# EAGLE design sch (EAGLE 7.6.0)
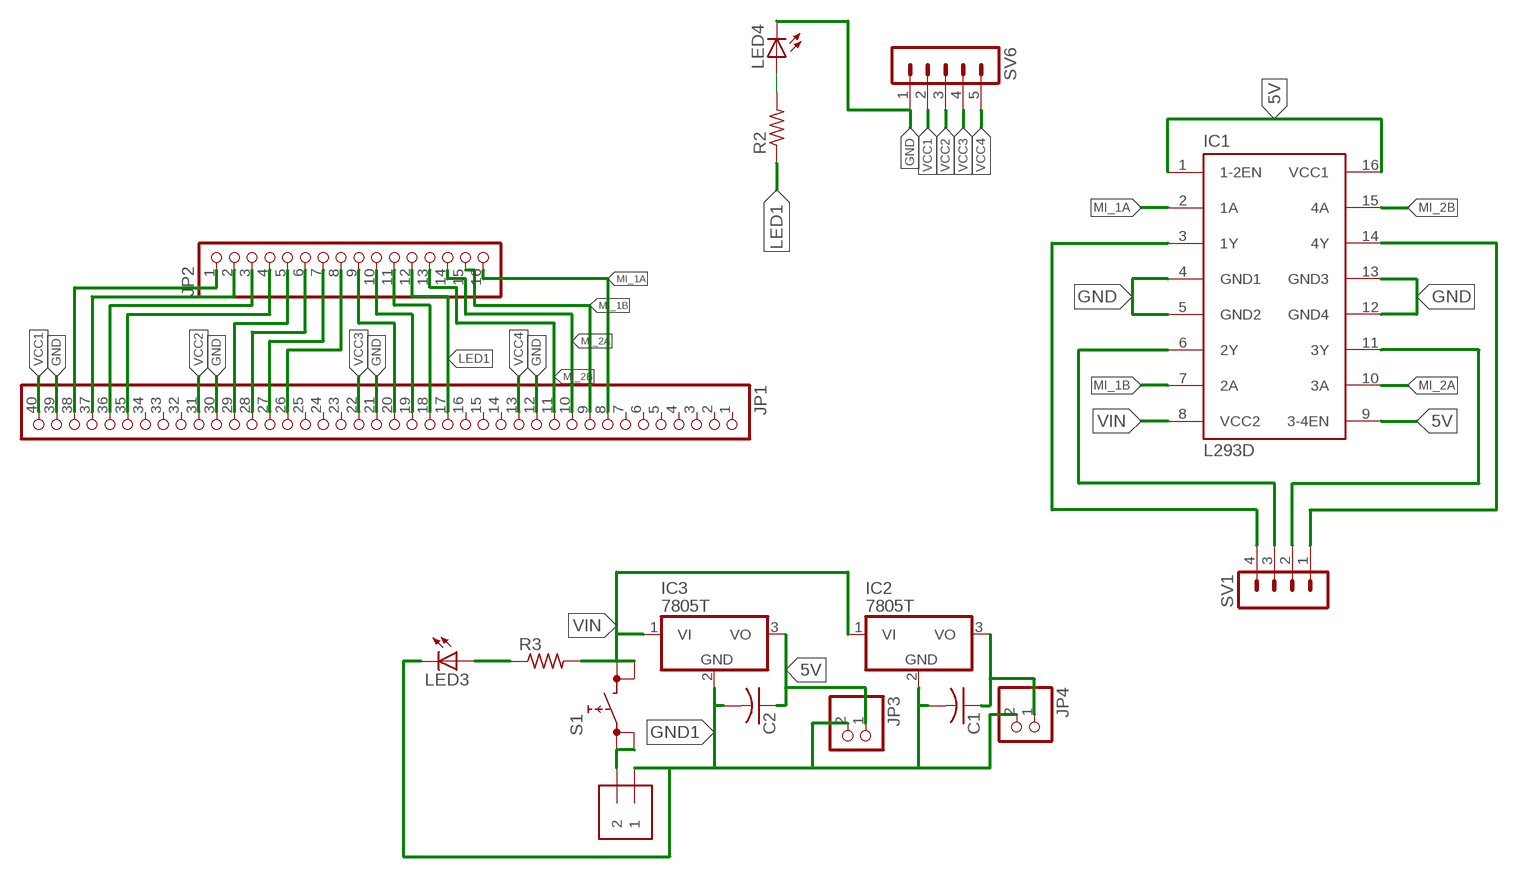
[diagram p0: schematic, sheet 1]

## Parts
C1  C-US025-024X044  [C025-024X044]
C2  C-US025-024X044  [C025-024X044]
IC1  L293D  [DIL16]
IC2  7805T  [TO220H]
IC3  7805T  [TO220H]
J1  1X2-3.5MM  [1X2-3.5MM]
JP1  PINHD-1X40  [1X40]
JP2  PINHD-1X16  [1X16]
JP3  PINHD-1X2  [1X02]
JP4  PINHD-1X2  [1X02]
LED3  LED5MM  [LED5MM]
LED4  LED5MM  [LED5MM]
R2  R-US_0204/2V  [0204V]
R3  R-US_0204/2V  [0204V]
S1  REKN  [REKN]
SV1  MA04-1  [MA04-1]
SV6  MA05-1  [MA05-1]

## Nets
5V: C2.1 IC1.1(1-2EN) IC1.9(3-4EN) IC1.16(VCC1) IC3.3(VO) JP3.1
GND: IC1.4(GND1) IC1.5(GND2) IC1.12(GND4) IC1.13(GND3) JP1.12 JP1.21 JP1.30 JP1.39 LED4.K(C) SV6.1
GND1: C1.2 C2.2 IC2.2(GND) IC3.2(GND) J1.1 JP3.2 JP4.2 LED3.K(C)
LED1: JP1.17 JP2.12 R2.1
MI_1A: IC1.2(1A) JP1.8 JP2.16
MI_1B: IC1.7(2A) JP1.9 JP2.15
MI_2A: IC1.10(3A) JP1.10 JP2.14
MI_2B: IC1.15(4A) JP1.11 JP2.13
N$2: IC1.14(4Y) SV1.1
N$3: IC1.11(3Y) SV1.2
N$4: C1.1 IC2.3(VO) JP4.1
N$5: JP1.35 JP2.4
N$6: JP1.27 JP2.7
N$7: JP1.26 JP2.8
N$8: LED4.A R2.2
N$9: JP1.38 JP2.1
N$10: JP1.37 JP2.2
N$11: JP1.36 JP2.3
N$12: J1.2 S1.0A S1.0B
N$13: JP1.29 JP2.5
N$14: JP1.28 JP2.6
N$15: LED3.A R3.1
N$16: IC1.6(2Y) SV1.3
N$17: JP1.20 JP2.9
N$18: JP1.19 JP2.10
N$19: JP1.18 JP2.11
N$21: IC1.3(1Y) SV1.4
VCC1: JP1.40 SV6.2
VCC2: JP1.31 SV6.3
VCC3: JP1.22 SV6.4
VCC4: JP1.13 SV6.5
VIN: IC1.8(VCC2) IC2.1(VI) IC3.1(VI) R3.2 S1.1A S1.1B
Unconnected: JP1.1 JP1.2 JP1.3 JP1.4 JP1.5 JP1.6 JP1.7 JP1.14 JP1.15 JP1.16 JP1.23 JP1.24 JP1.25 JP1.32 JP1.33 JP1.34

## Library data of the parts
C1 C2 = adafruit:C-US: CAPACITOR, American symbol
IC1 = st-microelectronics:L293D: PUSH-PULL 4 CHANNEL DRIVER; MPN: L293D; OC_FARNELL: 9589619; OC_NEWARK: 56P8249
IC2 IC3 = adafruit:78*: Positive VOLTAGE REGULATOR Added bigger pads to the TO-92 package
J1 = adafruit:1X2: 3.5mm Terminal block http://www.ladyada.net/library/pcb/eaglelibrary.html
JP1 = pinhead:PINHD-1X40: PIN HEADER
JP2 = pinhead:PINHD-1X16: PIN HEADER
JP3 JP4 = pinhead:PINHD-1X2: PIN HEADER
LED3 LED4 = adafruit:LED: LED OSRAM: - CHIPLED LG R971, LG N971, LY N971, LG Q971, LY Q971, LO R971, LY R971 LH N974, LH R974 LS Q976, LO Q976, LY Q976 LO Q996 - Hyper CHIPLED LW Q18S LB Q993, LB Q99A, LB R99A - SideLED LS A670, LO A670, LY A670, LG A670, LP A670 LB A673, LV A673, LT A673, LW A673 LH A674 LY A675 LS A676, LA A676, LO A676, LY A676, LW A676 LS A679, LY A679, LG A679 - Hyper Micro SIDELED® LS Y876, LA Y876, LO Y876, LY Y876 LT Y87S - SmartLED LW L88C, LW L88S LB L89C, LB L89S, LG L890 LS L89K, LO L89K, LY L89K LS L896, LA L896, LO L896, LY L896 - TOPLED LS T670, LO T670, LY T670, LG T670, LP T670 LSG T670, LSP T670, LSY T670, LOP T670, LYG T670 LG T671, LOG T671, LSG T671 LB T673, LV T673, LT T673, LW T673 LH T674 LS T676, LA T676, LO T676, LY T676, LB T676, LH T676, LSB T676, LW T676 LB T67C, LV T67C, LT T67C, LS T67K, LO T67K, LY T67K, LW E67C LS E67B, LA E67B, LO E67B, LY E67B, LB E67C, LV E67C, LT E67C LW T67C LS T679, LY T679, LG T679 LS T770, LO T770, LY T770, LG T770, LP T770 LB T773, LV T773, LT T773, LW T773 LH T774 LS E675, LA E675, LY E675, LS T675 LS T776, LA T776, LO T776, LY T776, LB T776 LHGB T686 LT T68C, LB T68C - Hyper Mini TOPLED® LB M676 - Mini TOPLED Santana® LG M470 LS M47K, LO M47K, LY M47K Source: http://www.osram.convergy.de/
R2 R3 = adafruit:R-US_: RESISTOR, American symbol
S1 = switch:REKN: PUSH SWITCH ITT-Cannon-Cannon
SV1 = con-lstb:MA04-1: PIN HEADER; OC_FARNELL: unknown; OC_NEWARK: unknown
SV6 = con-lstb:MA05-1: PIN HEADER; OC_FARNELL: unknown; OC_NEWARK: unknown

## Board
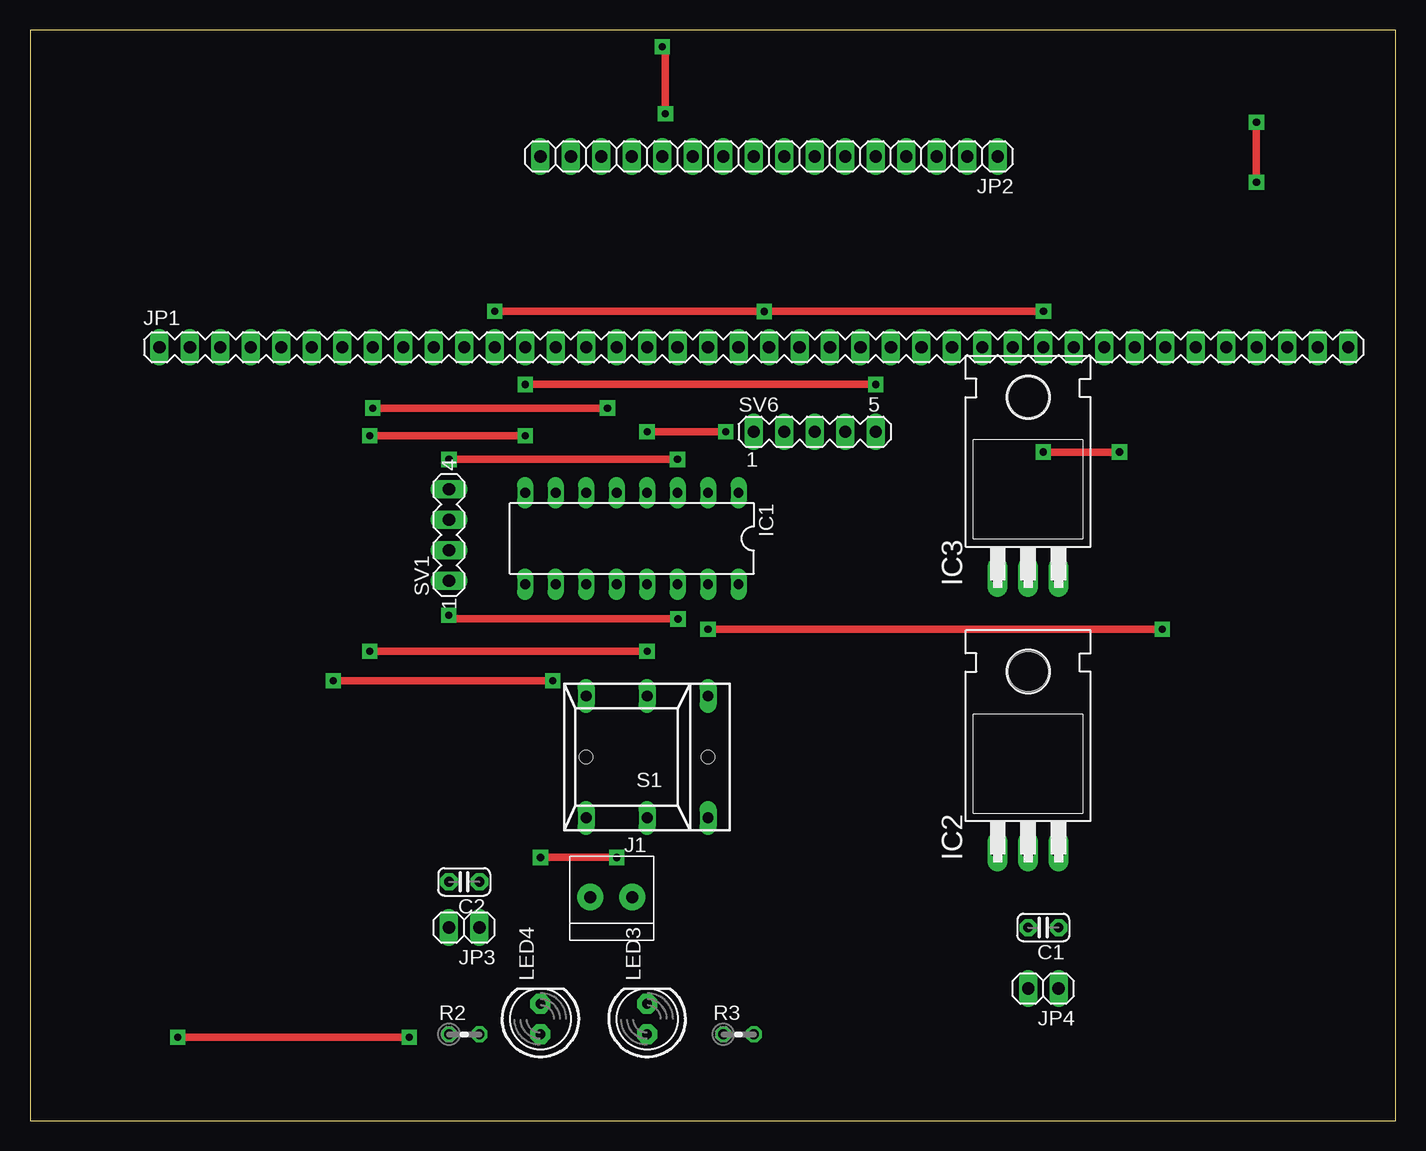
[diagram p1: board, top side]
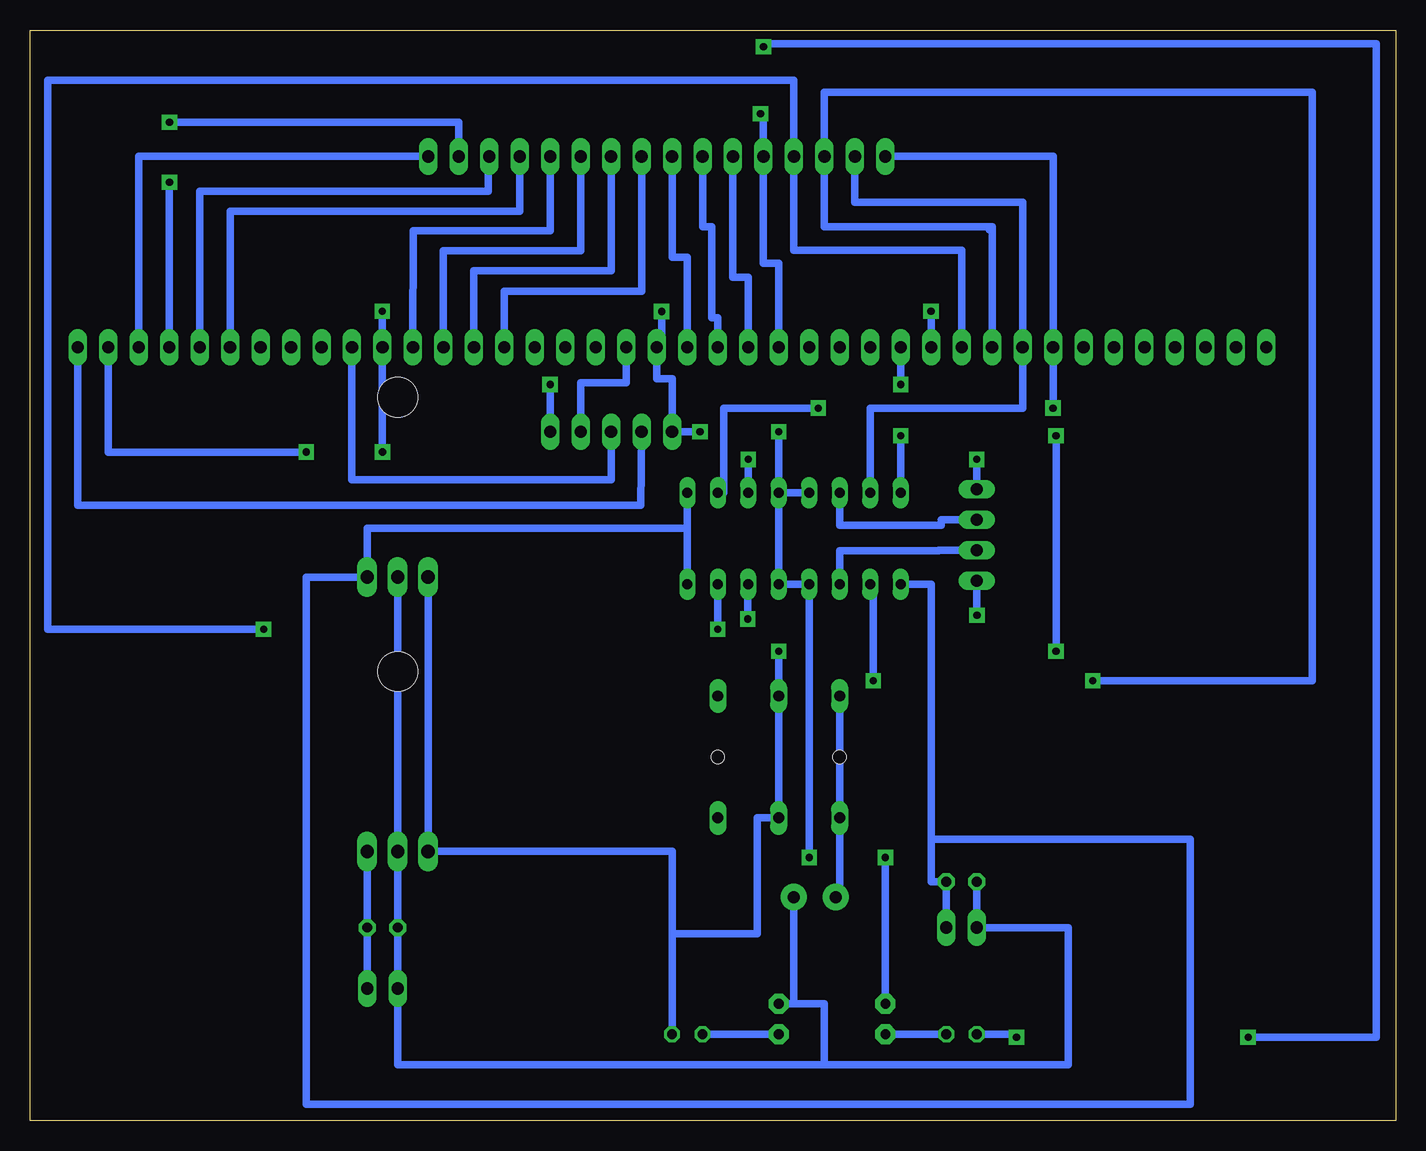
[diagram p2: board, bottom side, seen from below]

Size 113.82 x 90.88 mm. Coordinates in mm from the lower left corner, seen from the top.
Outline: 0,0 113.82,0 113.82,90.88 0,90.88 0,0
Copper layers (1*16): Top 0.035mm / dielectric 1.5mm / Bottom 0.035mm
Design rules "default *": minimum track width 10mil, minimum drill 24mil, track to track 40mil, track to pad 40mil, pad to pad 8mil, via to via 40mil, smd to smd 8mil, copper to edge 40mil, drill to drill 8mil, minimum pad ring 10mil, minimum via ring 8mil, stop-mask expansion 4mil, vias tented up to drill 0mil, thermal gap 10mil

### Footprints (pad centres in the part's own frame; a part is rotated, then mirrored left to right if it is on the bottom)
C025-024X044 = drill 0.813 pad 1.422 octagon: 1 -1.27,0; 2 1.27,0
DIL16 = drill 0.813 long: 1 -8.89,-3.81; 2 -6.35,-3.81; 3 -3.81,-3.81; 4 -1.27,-3.81; 5 1.27,-3.81; 6 3.81,-3.81; 7 6.35,-3.81; 8 8.89,-3.81; 9 8.89,3.81; 10 6.35,3.81; 11 3.81,3.81; 12 1.27,3.81; 13 -1.27,3.81; 14 -3.81,3.81; 15 -6.35,3.81; 16 -8.89,3.81
TO220H = drill 1.118 long: 1 -2.54,-10.16; 2 0,-10.16; 3 2.54,-10.16 | hole 3.302: 0,4.826
1X2-3.5MM = drill 1 pad 2.184: 1 1.8,0; 2 -1.7,0
1X40 = drill 1.016 pad 1.5 long: 1 -49.53,0; 2 -46.99,0; 3 -44.45,0; 4 -41.91,0; 5 -39.37,0; 6 -36.83,0; 7 -34.29,0; 8 -31.75,0; 9 -29.21,0; 10 -26.67,0; 11 -24.13,0; 12 -21.59,0; 13 -19.05,0; 14 -16.51,0; 15 -13.97,0; 16 -11.43,0; 17 -8.89,0; 18 -6.35,0; 19 -3.81,0; 20 -1.27,0; 21 1.27,0; 22 3.81,0; 23 6.35,0; 24 8.89,0; 25 11.43,0; 26 13.97,0; 27 16.51,0; 28 19.05,0; 29 21.59,0; 30 24.13,0; 31 26.67,0; 32 29.21,0; 33 31.75,0; 34 34.29,0; 35 36.83,0; 36 39.37,0; 37 41.91,0; 38 44.45,0; 39 46.99,0; 40 49.53,0
1X16 = drill 1.016 long: 1 -19.05,0; 2 -16.51,0; 3 -13.97,0; 4 -11.43,0; 5 -8.89,0; 6 -6.35,0; 7 -3.81,0; 8 -1.27,0; 9 1.27,0; 10 3.81,0; 11 6.35,0; 12 8.89,0; 13 11.43,0; 14 13.97,0; 15 16.51,0; 16 19.05,0
1X02 = drill 1.016 long: 1 -1.27,0; 2 1.27,0
LED5MM = drill 0.813 pad 1.676 octagon: A -1.27,0; K 1.27,0
0204V = drill 0.813 octagon: 1 -1.27,0; 2 1.27,0
REKN = drill 0.9 long: 0A 5.08,5.08; 0B 5.08,-5.08; 1A 0,5.08; 1B 0,-5.08; A -5.08,5.08; B -5.08,-5.08 | hole 1.1: -5.08,0; 5.08,0
MA04-1 = drill 1.016 long: 1 -3.81,0; 2 -1.27,0; 3 1.27,0; 4 3.81,0
MA05-1 = drill 1.016 long: 1 -5.08,0; 2 -2.54,0; 3 0,0; 4 2.54,0; 5 5.08,0

### Placement (x,y rotation side)
C1  84.45,16.08 180 top
C2  36.19,19.89 180 top
IC1  50.16,48.5 180 top
IC2  83.18,32.59 0 top
IC3  83.18,55.45 0 top
J1  48.38,18.62 0 top
JP1  60.32,64.44 0 top
JP2  61.59,80.34 180 top
JP3  36.19,16.08 180 top
JP4  84.45,11 180 top
LED3  51.43,8.46 90 top
LED4  42.54,8.46 90 top
R2  36.19,7.19 0 top
R3  59.05,7.19 0 top
S1  51.43,30.3 180 top
SV1  34.92,48.8 90 top
SV6  65.4,57.39 0 top

### Tracks (layer width: path | path; a pad name or v marks a point on that pad's centre or on a via)
5V
  Bottom 0.61: 59.05,49.37 85.72,49.37 IC3.3 90.8,45.29 90.8,1.35 17.14,1.35 17.14,23.45 38.73,23.45 | 59.05,49.37 IC1.1 | 59.05,49.37 IC1.16 | JP3.1 C2.1 38.73,19.89 38.73,23.45 | IC1.9 38.73,44.69 38.73,23.45
GND  (via drill 0.6 pad 1.27)
  Top 0.61: v90.8,55.7 v84.45,55.7 | v48.89,21.92 v42.54,21.92 | v51.43,57.39 v57.99,57.39 | v61.18,67.43 v38.73,67.43 | v61.18,67.42 v84.46,67.43 v84.46,67.44
  Bottom 0.61: JP1.21 61.59,61.8 60.32,61.8 SV6.1 v57.99,57.39 | JP1.39 107.31,55.7 v90.8,55.7 | v84.45,55.7 84.45,63.93 | 84.45,63.93 JP1.30 | IC1.5 IC1.4 | IC1.4 IC1.13 IC1.12 v48.89,21.92 | v42.54,21.92 LED4.K | IC1.4 v51.43,57.39 | JP1.21 61.18,64.44 v61.18,67.43 | v38.73,67.43 JP1.12 | JP1.21 61.18,64.43 v61.18,67.42 | v84.46,67.44 84.45,67.44 84.45,63.93
GND1
  Bottom 0.406: IC2.2 C1.2 JP4.2
  Bottom 0.61: C2.2 JP3.2 27.3,16.08 27.3,4.65 47.62,4.65 | 47.62,4.65 47.62,9.73 LED3.K 50.18,9.73 J1.1 | IC3.2 IC2.2 83.18,4.65 47.62,4.65
LED1  (via drill 0.6 pad 1.27)
  Top 0.61: v31.61,6.93 v12.31,6.93 | v52.7,89.48 52.95,89.48 v52.95,83.9
  Bottom 0.61: JP1.17 51.43,71.45 52.7,71.45 JP2.12 52.7,83.9 v52.95,83.9 | R2.1 31.61,7.19 v31.61,6.93 | v12.31,6.93 1.64,6.93 1.64,89.74 52.7,89.74 v52.7,89.48
MI_1A  (via drill 0.6 pad 1.27)
  Top 0.61: v48.12,59.37 v28.57,59.37
  Bottom 0.61: JP2.16 28.57,80.34 JP1.8 v28.57,59.37 | v48.12,59.37 56,59.37 56,52.31 IC1.2
MI_1B
  Bottom 0.61: JP2.15 45.08,76.53 31.11,76.53 JP1.9 31.11,59.35 43.81,59.35 IC1.7
MI_2A  (via drill 0.6 pad 1.27)
  Top 0.61: v43.55,36.65 v25.26,36.65
  Bottom 0.61: 33.65,74.25 33.65,74.5 33.9,74.5 | JP1.10 33.65,74.25 | 33.65,74.25 33.9,74.25 33.9,74.5 | 33.9,74.5 47.62,74.5 JP2.14 47.62,85.67 6.98,85.67 6.98,36.65 v25.26,36.65 | IC1.10 43.55,45.29 v43.55,36.65
MI_2B  (via drill 0.6 pad 1.27)
  Top 0.61: v56.51,40.94 v94.35,40.94
  Bottom 0.61: JP1.11 36.19,72.51 50.16,72.51 JP2.13 50.16,86.69 112.36,86.69 112.35,40.94 v94.35,40.94 | IC1.15 v56.51,40.94
N$2  (via drill 0.6 pad 1.27)
  Top 0.61: v54,41.8 34.9,41.8 v34.9,42.1
  Bottom 0.61: IC1.14 54,45.29 v54,41.8 | v34.9,42.1 34.92,42.1 SV1.1
N$3
  Bottom 0.61: SV1.2 38.1,47.53 38.1,47.5 46.35,47.5 IC1.11
N$4
  Bottom 0.61: JP4.1 C1.1 IC2.3
N$5
  Bottom 0.61: JP2.4 73.02,75.79 97.15,75.79 JP1.35
N$6
  Bottom 0.61: JP1.27 76.83,70.83 65.4,70.83 JP2.7
N$7
  Bottom 0.61: JP2.8 62.86,69.1 74.29,69.1 JP1.26
N$8
  Bottom 0.61: LED4.A R2.2
N$9
  Bottom 0.61: JP2.1 104.77,80.34 JP1.38
N$10  (via drill 0.6 pad 1.27)
  Top 0.61: v102.2,78.2 v102.2,83.2
  Bottom 0.61: JP1.37 102.2,64.44 v102.2,78.2 | v102.2,83.2 78.1,83.2 JP2.2
N$11
  Bottom 0.61: JP2.3 75.62,80.34 75.62,77.45 99.69,77.45 JP1.36
N$12
  Bottom 0.61: S1.0B S1.0A 46.35,18.62 J1.2
N$13
  Bottom 0.61: JP2.5 70.47,74.15 81.9,74.15 JP1.29
N$14
  Bottom 0.61: JP2.6 67.94,72.48 79.37,72.48 JP1.28
N$15
  Bottom 0.61: LED3.A R3.1
N$16
  Bottom 0.61: SV1.3 37.9,50.07 37.9,49.6 46.35,49.6 IC1.6
N$17
  Bottom 0.61: JP2.9 60.32,71.96 59.05,71.96 JP1.20
N$18
  Bottom 0.61: JP2.10 57.78,74.5 57.01,74.5 57.01,66.88 56.51,66.88 JP1.19
N$19
  Bottom 0.61: JP2.11 55.24,70.29 53.97,70.29 JP1.18
N$21  (via drill 0.6 pad 1.27)
  Top 0.61: v34.92,55.09 v53.97,55.09
  Bottom 0.61: SV1.4 v34.92,55.09 | v53.97,55.09 IC1.3
VCC1
  Bottom 0.61: SV6.2 62.9,51.27 109.85,51.25 JP1.40
VCC2
  Bottom 0.61: SV6.3 65.4,53.42 86.99,53.42 JP1.31
VCC3
  Bottom 0.61: SV6.4 67.94,61.49 64.13,61.49 JP1.22
VCC4  (via drill 0.6 pad 1.27)
  Top 0.61: v70.48,61.34 v41.27,61.34
  Bottom 0.61: SV6.5 v70.48,61.34 | v41.27,61.34 JP1.13
VIN  (via drill 0.6 pad 1.27)
  Top 0.61: v51.43,39.1 v28.31,39.1 | v28.31,57.07 v41.27,57.07
  Bottom 0.61: v51.43,39.1 S1.1B S1.1A 53.2,25.22 53.2,15.57 60.32,15.57 | v28.31,39.1 28.31,41.23 v28.31,57.07 | v41.27,57.07 IC1.8 | R3.2 60.32,15.57 | 60.32,15.57 60.32,22.43 IC2.1 IC3.1